# Altium schematic sheet I2C Peripherals.SCHDOC
size A4; Revision: B.2
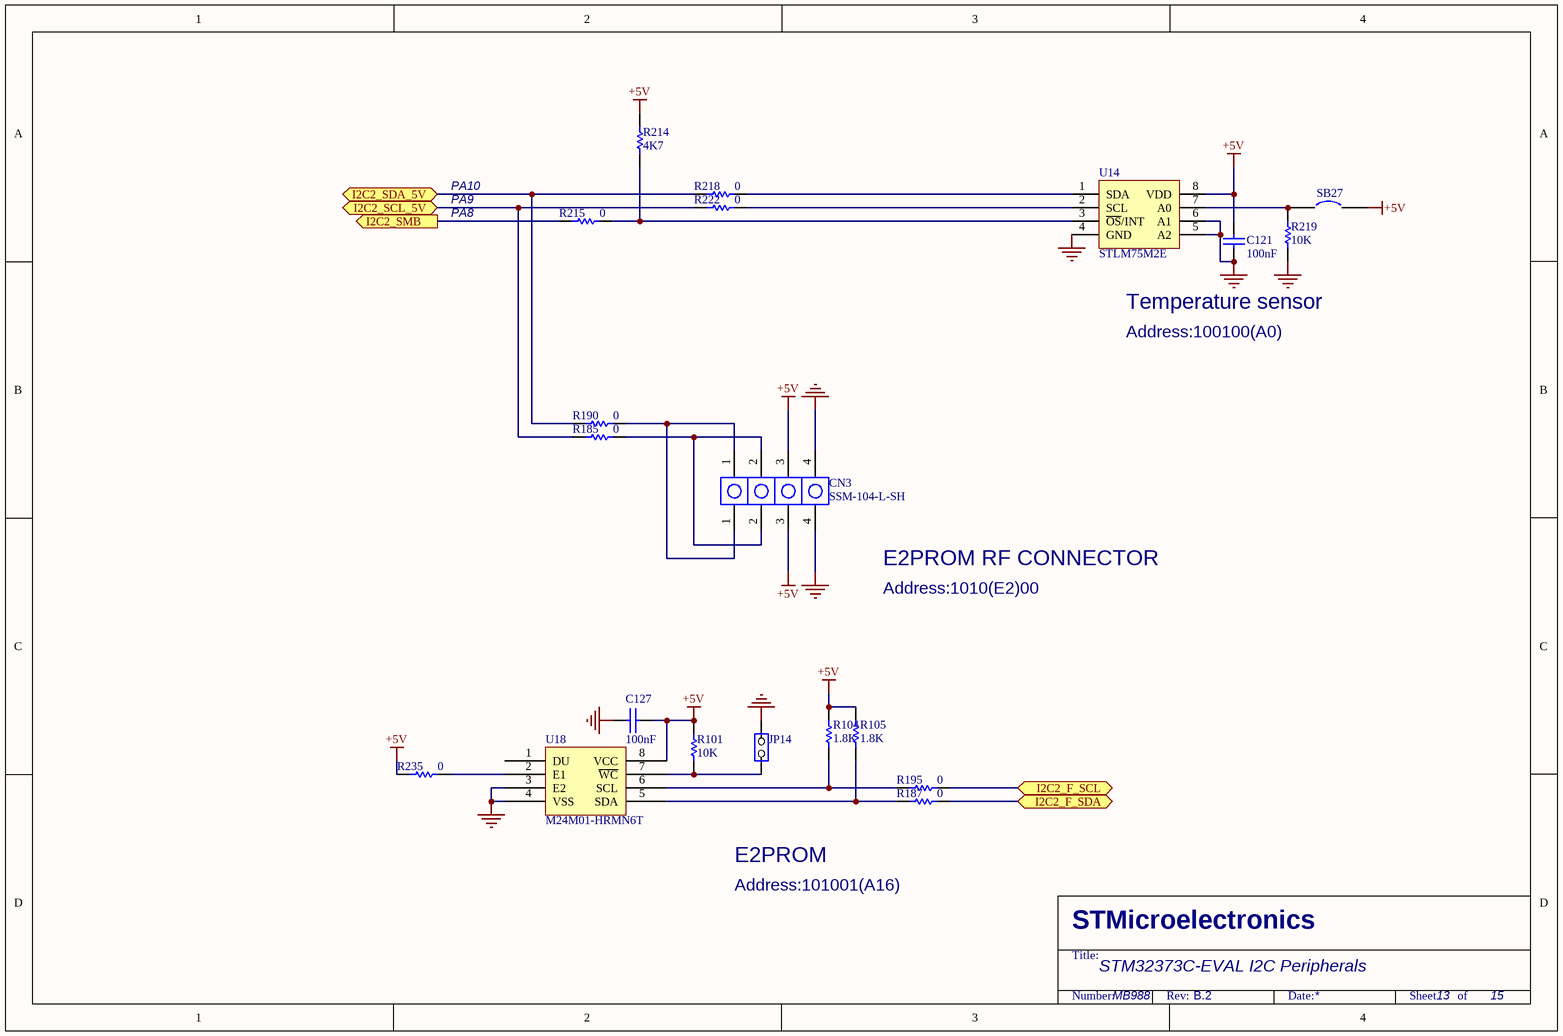
[diagram p0: I2C Peripherals.SCHDOC]

## Parts
C121  100nF  [0603C]
C127  100nF  [0603C]
CN3  SSM-104-L-SH  [SSM-104-L-SH]
JP14  (no value)  [SIP2]
R101  10K  [0603R]
R104  1.8K  [0603R]
R105  1.8K  [0603R]
R185  0  [0603R]
R187  0  [0603R]
R190  0  [0603R]
R195  0  [0603R]
R214  4K7  [0603R]
R215  0  [0603R]
R218  0  [0603R]
R219  10K  [0603R]
R222  0  [0603R]
R235  0  [0603R]
SB27  (no value)  [JP2_SMD]
U14  STLM75M2E  [SO8]
U18  M24M01-HRMN6T  [SO8]

## Ports
I2C2_F_SCL (bidir), I2C2_F_SDA (bidir), I2C2_SCL_5V (bidir), I2C2_SDA_5V (bidir), I2C2_SMB (out)

## Nets
+5V: C121.2 C127.2 CN3.3 R101.1 R104.2 R105.2 R214.2 R235.1 SB27.2 U14.8(VDD) U18.8(VCC)
GND: C121.1 C127.1 CN3.4 JP14.2(NO) R219.1 U14.4(GND) U14.5(A2) U14.6(A1) U18.3(E2) U18.4(VSS)
I2C2_F_SCL: R195.2 ; port I2C2_F_SCL
I2C2_F_SDA: R187.2 ; port I2C2_F_SDA
I2C2_SCL_5V: R185.1 R222.1 ; port I2C2_SCL_5V
I2C2_SDA_5V: R190.1 R218.1 ; port I2C2_SDA_5V
I2C2_SMB: R215.2 ; port I2C2_SMB
NetCN3_1: CN3.1 R190.2
NetCN3_2: CN3.2 R185.2
NetJP14_1: JP14.1(COMMON) R101.2 U18.7(~{WC})
NetR104_1: R104.1 R195.1 U18.6(SCL)
NetR105_1: R105.1 R187.1 U18.5(SDA)
NetR214_1: R214.1 R215.1 U14.3(~{OS}/INT)
NetR218_2: R218.2 U14.1(SDA)
NetR219_2: R219.2 SB27.1 U14.7(A0)
NetR222_2: R222.2 U14.2(SCL)
NetR235_2: R235.2 U18.2(E1)

Not connected (* = marked no-connect by the designer): U18 1(DU)

## Notes on the sheet
- PA10
- PA9
- PA8
- Temperature sensor
- Address:100100(A0)
- E2PROM RF CONNECTOR
- Address:1010(E2)00
- Address:101001(A16)
- E2PROM
- STM32373C-EVAL I2C Peripherals
- MB988
- 13
- 15
- STMicroelectronics
- Title:
- Number:
- Rev:
- Date:
- Sheet       of

## Library data of the parts
C121 = cap: Capacitor; Value: 100pF; Published: 8-Jun-2000; Revision: July-2002: Re-released for DXP Platform.; Publisher: Altium Limited
C127 = CAP: Capacitor
JP14 = JP2
R101 = res1: Resistor; Value: 1K; Published: 8-Jun-2000; Revision: July-2002: Re-released for DXP Platform.; Publisher: Altium Limited
R104 R105 R185 R187 R190 R195 R214 R215 R218 R219 R222 R235 = Res1: Resistor; Value: 1K; Published: 8-Jun-2000; Revision: July-2002: Re-released for DXP Platform.; Publisher: Altium Limited
SB27 = Circuit Breaker: Published: 24-Mar-1999; Revision: July-2002: Re-released for DXP Platform.; Publisher: Altium Limited
U14 = STLM75DW2F
U18 = M24M01